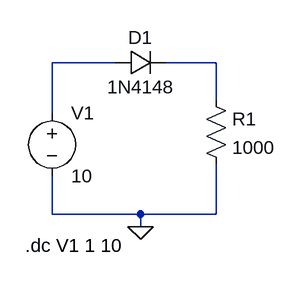
[diagram p0: schematic forward bias diode.asc]
forward bias diode.asc, the LTspice schematic file:
Version 4
SHEET 1 880 680
WIRE 128 64 48 64
WIRE 256 64 192 64
WIRE 256 112 256 64
WIRE 48 128 48 64
WIRE 48 256 48 208
WIRE 160 256 48 256
WIRE 256 256 256 192
WIRE 256 256 160 256
WIRE 160 272 160 256
FLAG 160 272 0
SYMBOL diode 128 80 R270
WINDOW 0 32 32 VTop 2
WINDOW 3 0 32 VBottom 2
SYMATTR InstName D1
SYMATTR Value 1N4148
SYMBOL res 240 96 R0
SYMATTR InstName R1
SYMATTR Value 1000
SYMBOL voltage 48 112 R0
WINDOW 123 0 0 Left 0
WINDOW 39 0 0 Left 0
SYMATTR InstName V1
SYMATTR Value 10
TEXT 14 296 Left 2 !.dc V1 1 10

The netlist it stands for:
* forward bias diode.asc
D1 N001 N002 1N4148
R1 N002 0 1000
V1 N001 0 10
.model D D
.lib standard.dio
.dc V1 1 10
.backanno
.end